# EAGLE design LED (EAGLE 6.5.0)
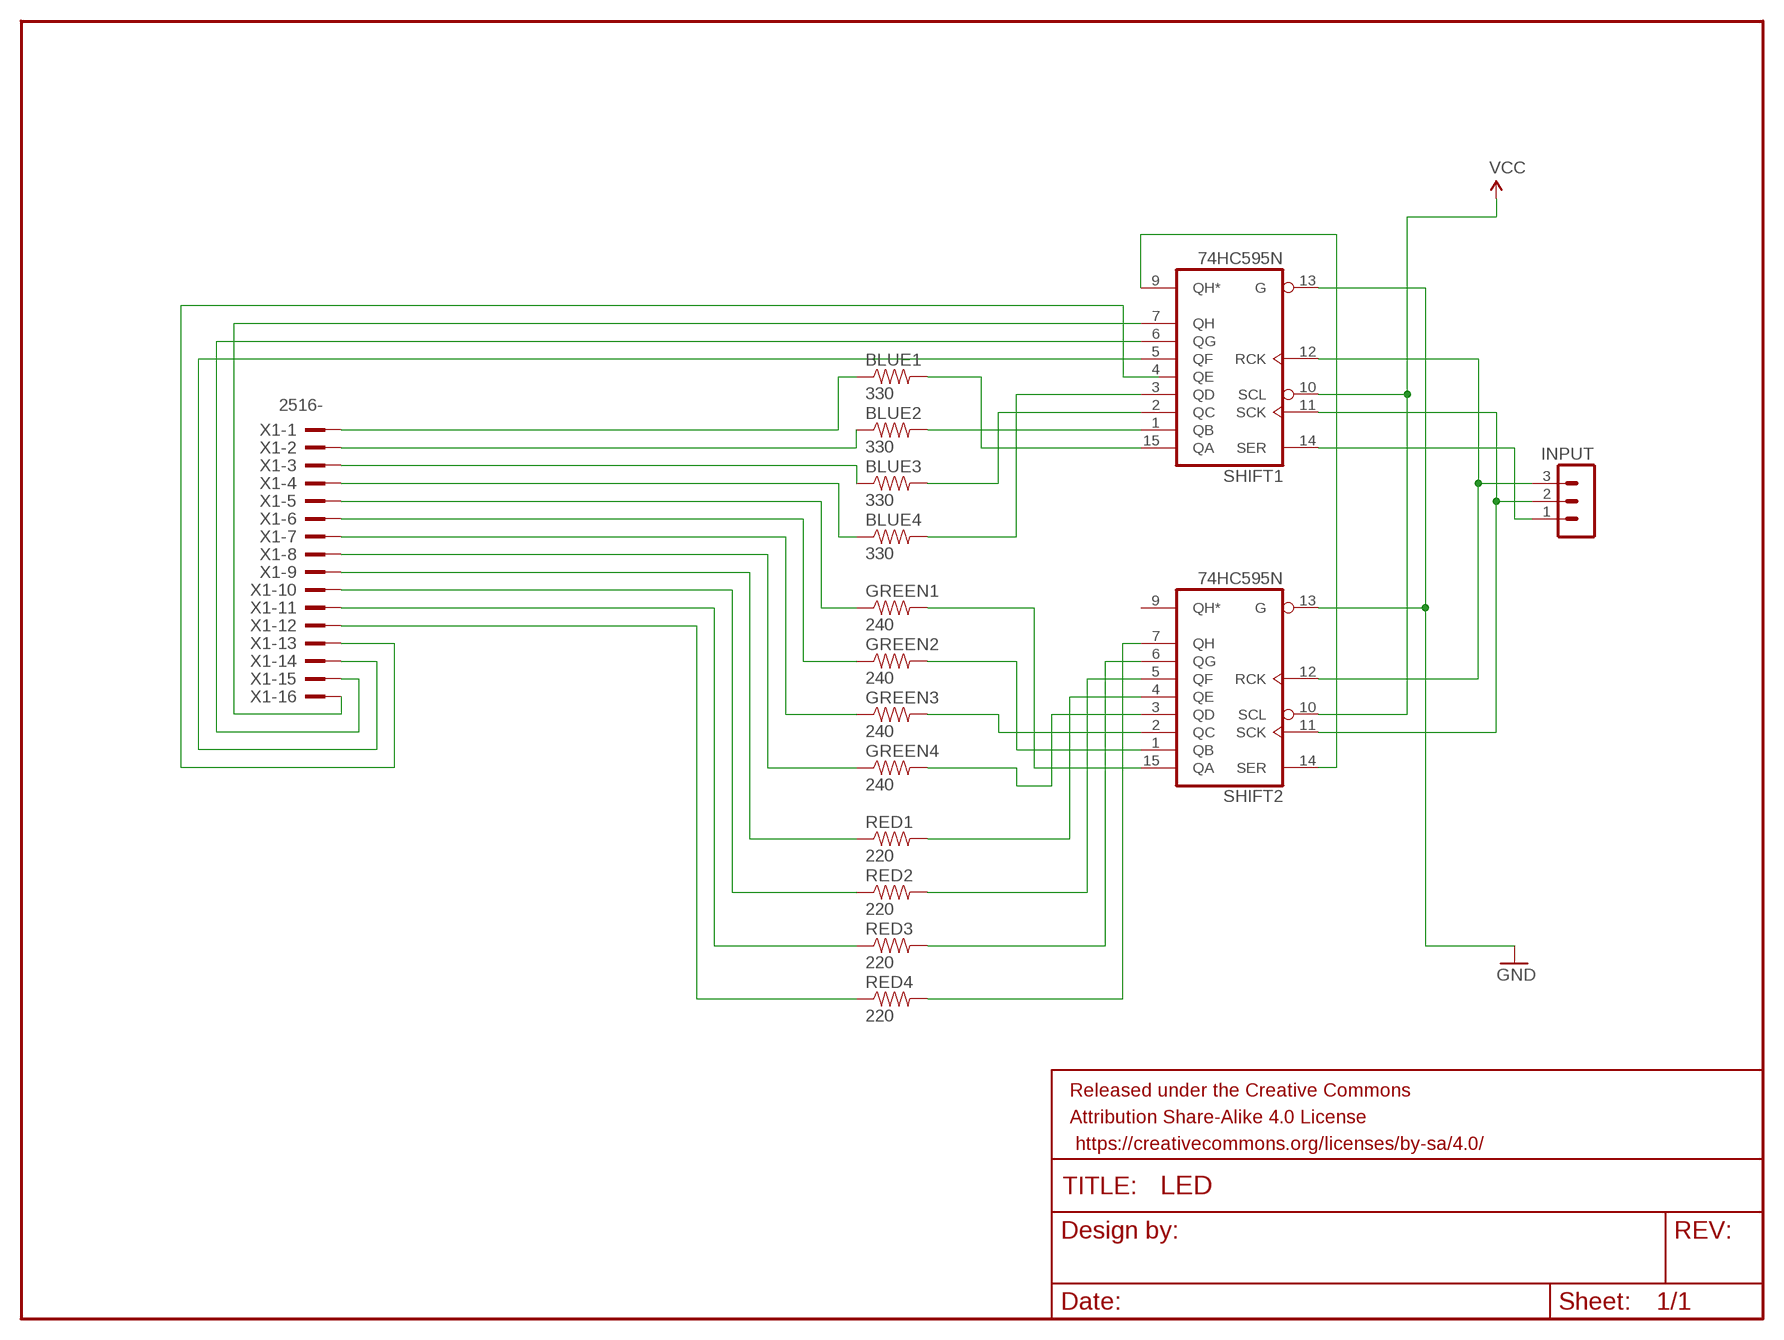
[diagram p0: schematic, sheet 1]

## Parts
BLUE1  330  RESISTOREZ  [AXIAL-0.3EZ]
BLUE2  330  RESISTOREZ  [AXIAL-0.3EZ]
BLUE3  330  RESISTOREZ  [AXIAL-0.3EZ]
BLUE4  330  RESISTOREZ  [AXIAL-0.3EZ]
FRAME1  FRAME-LETTER  [CREATIVE_COMMONS]
GREEN1  240  RESISTOREZ  [AXIAL-0.3EZ]
GREEN2  240  RESISTOREZ  [AXIAL-0.3EZ]
GREEN3  240  RESISTOREZ  [AXIAL-0.3EZ]
GREEN4  240  RESISTOREZ  [AXIAL-0.3EZ]
INPUT  MA03-1  [MA03-1]
RED1  220  RESISTOREZ  [AXIAL-0.3EZ]
RED2  220  RESISTOREZ  [AXIAL-0.3EZ]
RED3  220  RESISTOREZ  [AXIAL-0.3EZ]
RED4  220  RESISTOREZ  [AXIAL-0.3EZ]
SHIFT1  74HC595N  [DIL16]
SHIFT2  74HC595N  [DIL16]
X1  2516-  [PAK100/2500-16]

## Nets
GND: SHIFT1.13(G) SHIFT2.13(G)
N$1: BLUE4.P$1 X1.4
N$2: BLUE3.P$1 X1.3
N$3: BLUE2.P$1 X1.2
N$4: BLUE1.P$1 X1.1
N$5: BLUE1.P$2 SHIFT1.15(QA)
N$6: BLUE2.P$2 SHIFT1.1(QB)
N$7: BLUE3.P$2 SHIFT1.2(QC)
N$8: BLUE4.P$2 SHIFT1.3(QD)
N$9: SHIFT1.7(QH) X1.16
N$10: SHIFT1.6(QG) X1.15
N$11: SHIFT1.5(QF) X1.14
N$12: X1.13
N$13: GREEN1.P$1 X1.5
N$14: GREEN2.P$1 X1.6
N$15: GREEN3.P$1 X1.7
N$16: GREEN4.P$1 X1.8
N$17: RED1.P$1 X1.9
N$18: RED2.P$1 X1.10
N$19: RED3.P$1 X1.11
N$20: RED4.P$1 X1.12
N$21: GREEN1.P$2 SHIFT2.15(QA)
N$22: GREEN2.P$2 SHIFT2.1(QB)
N$23: GREEN3.P$2 SHIFT2.2(QC)
N$24: GREEN4.P$2 SHIFT2.3(QD)
N$25: RED1.P$2 SHIFT2.4(QE)
N$26: RED2.P$2 SHIFT2.5(QF)
N$27: RED3.P$2 SHIFT2.6(QG)
N$28: RED4.P$2 SHIFT2.7(QH)
N$29: INPUT.3 SHIFT1.12(RCK) SHIFT2.12(RCK)
N$30: INPUT.2 SHIFT1.11(SCK) SHIFT2.11(SCK)
N$31: INPUT.1 SHIFT1.14(SER)
N$32: SHIFT1.9(QH*) SHIFT2.14(SER)
VCC: SHIFT1.10(SCL) SHIFT2.10(SCL)
Unconnected: SHIFT1.4(QE) SHIFT2.9(QH*)

## Power pins joined to a net without a drawn wire
GND: SHIFT1.8(GND) SHIFT2.8(GND)
VCC: SHIFT1.16(VCC) SHIFT2.16(VCC)

## Library data of the parts
BLUE1-BLUE4 GREEN1-GREEN4 RED1-RED4 = SparkFun-Resistors:RESISTOR: Resistor Basic schematic elements and footprints for 0603, 1206, and PTH resistors.
FRAME1 = SparkFun-Aesthetics:FRAME-LETTER: Schematic Frame Standard 8.5x11 US Letter frame
INPUT = con-lstb:MA03-1: PIN HEADER; OC_FARNELL: unknown; OC_NEWARK: unknown
SHIFT1 SHIFT2 = 74xx-eu:74*595: 8-bit SHIFT REGISTER, output latch
X1 = con-3m:2516-: 3M (TM) Pak 100 4-Wall Header Source: 3M; OC_FARNELL: unknown; OC_NEWARK: unknown

## Board
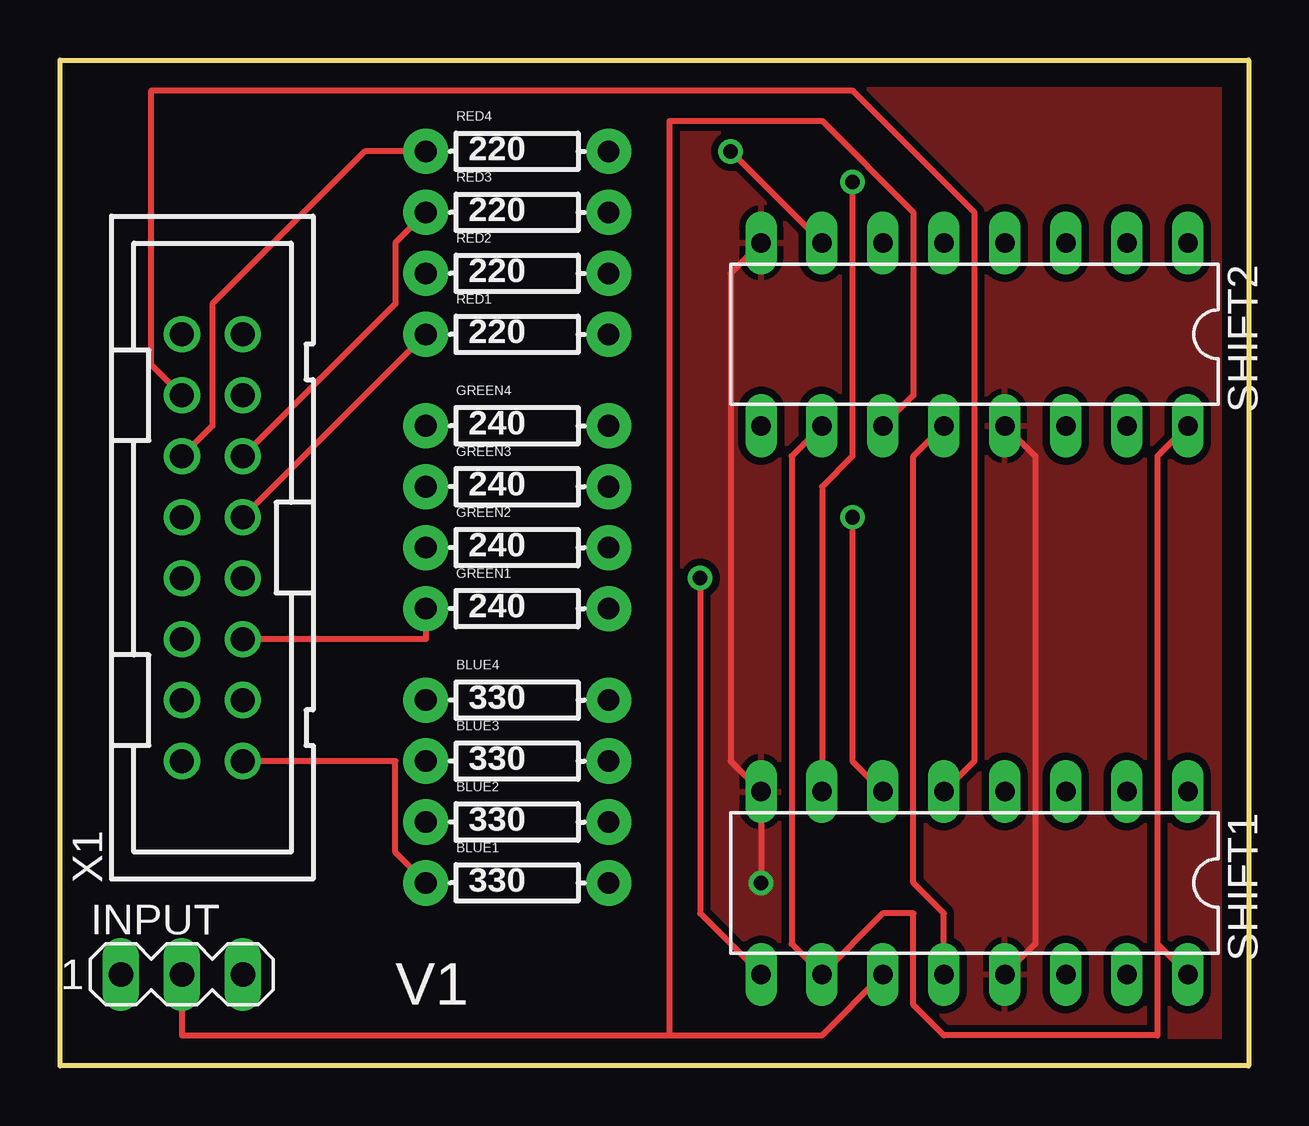
[diagram p1: board, top side]
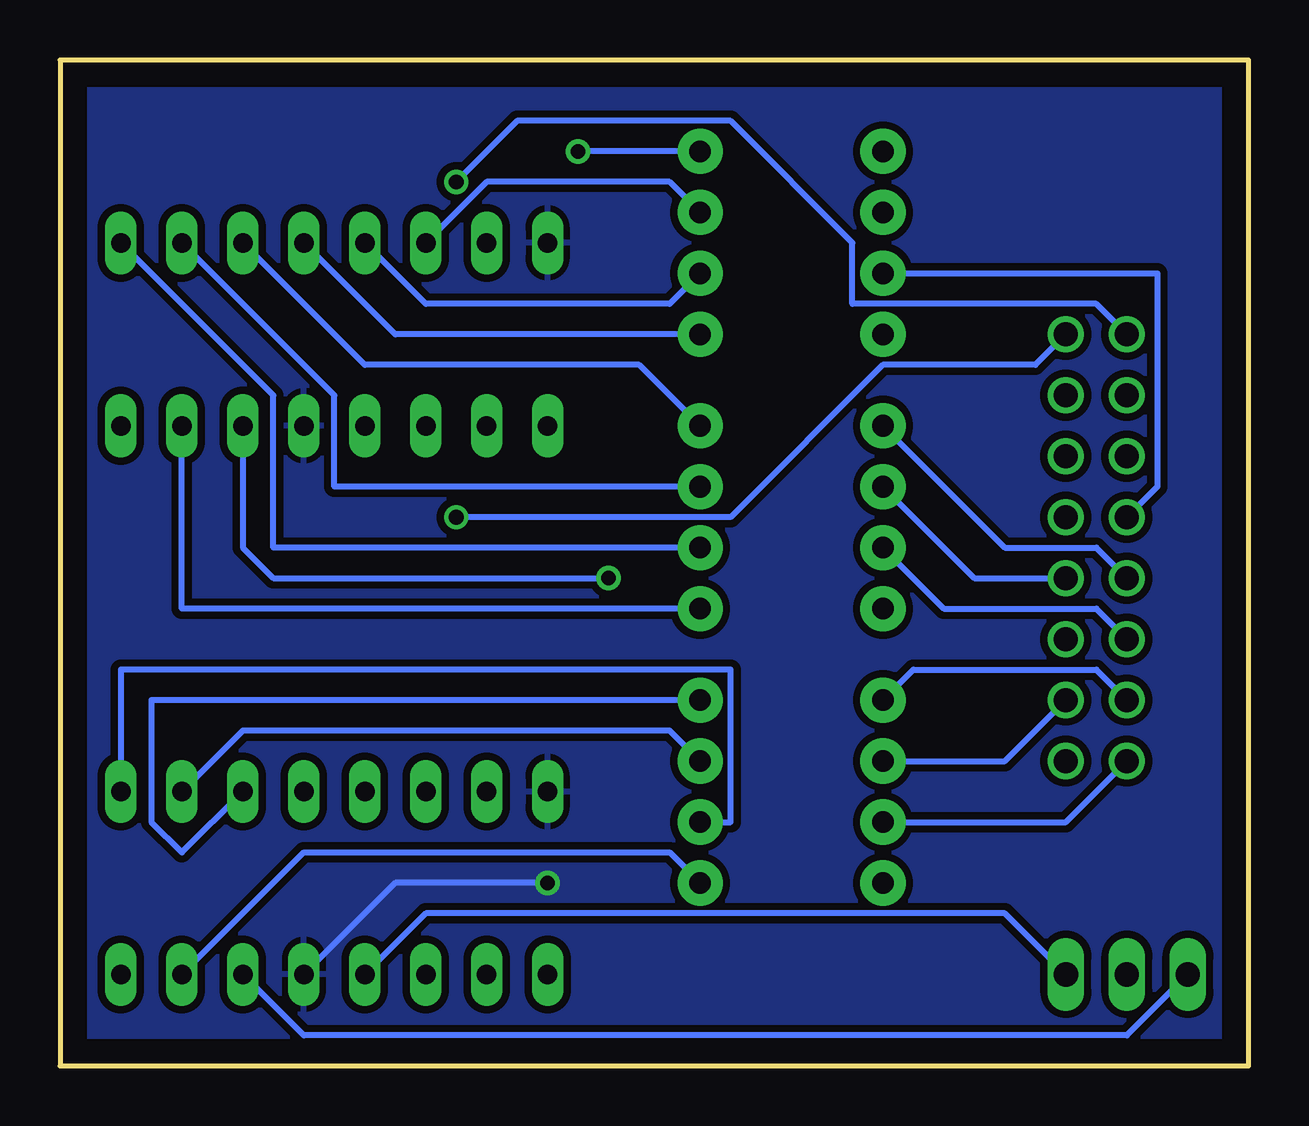
[diagram p2: board, bottom side, seen from below]

Size 49.53 x 41.91 mm. Coordinates in mm from the lower left corner, seen from the top.
Outline: 0,0 0,41.91 49.53,41.91 49.53,0 0,0
Copper layers (1*16): Top 0.035mm / dielectric 1.5mm / Bottom 0.035mm
Design rules "default": minimum track width 10mil, minimum drill 24mil, track to track 8mil, track to pad 8mil, pad to pad 8mil, via to via 8mil, smd to smd 8mil, copper to edge 40mil, drill to drill 8mil, minimum pad ring 10mil, minimum via ring 8mil, stop-mask expansion 4mil, vias tented up to drill 0mil, thermal gap 10mil

### Footprints (pad centres in the part's own frame; a part is rotated, then mirrored left to right if it is on the bottom)
AXIAL-0.3EZ = drill 0.9 pad 1.88: P$1 -3.81,0; P$2 3.81,0
MA03-1 = drill 1.016 long: 1 -2.54,0; 2 0,0; 3 2.54,0
DIL16 = drill 0.813 long: 1 -8.89,-3.81; 2 -6.35,-3.81; 3 -3.81,-3.81; 4 -1.27,-3.81; 5 1.27,-3.81; 6 3.81,-3.81; 7 6.35,-3.81; 8 8.89,-3.81; 9 8.89,3.81; 10 6.35,3.81; 11 3.81,3.81; 12 1.27,3.81; 13 -1.27,3.81; 14 -3.81,3.81; 15 -6.35,3.81; 16 -8.89,3.81
PAK100/2500-16 = drill 1 pad 1.422: 1 -8.89,-1.27; 2 -8.89,1.27; 3 -6.35,-1.27; 4 -6.35,1.27; 5 -3.81,-1.27; 6 -3.81,1.27; 7 -1.27,-1.27; 8 -1.27,1.27; 9 1.27,-1.27; 10 1.27,1.27; 11 3.81,-1.27; 12 3.81,1.27; 13 6.35,-1.27; 14 6.35,1.27; 15 8.89,-1.27; 16 8.89,1.27

### Placement (x,y rotation side)
BLUE1  19.05,7.62 0 top
BLUE2  19.05,10.16 0 top
BLUE3  19.05,12.7 0 top
BLUE4  19.05,15.24 0 top
FRAME1  -78.74,36.83 0 top  (outside the outline)
GREEN1  19.05,19.05 0 top
GREEN2  19.05,21.59 0 top
GREEN3  19.05,24.13 0 top
GREEN4  19.05,26.67 0 top
INPUT  5.08,3.81 0 top
RED1  19.05,30.48 0 top
RED2  19.05,33.02 0 top
RED3  19.05,35.56 0 top
RED4  19.05,38.1 0 top
SHIFT1  38.1,7.62 180 top
SHIFT2  38.1,30.48 180 top
X1  6.35,21.59 90 top

### Tracks (layer width: path | path; a pad name or v marks a point on that pad's centre or on a via)
GND  (via drill 0.61)
  Top 0.254: SHIFT1.13 40.64,5.08 40.64,25.4 SHIFT2.13 | SHIFT2.8 27.94,33.02 27.94,12.7 SHIFT1.8 v29.21,7.62
  Bottom 0.254: SHIFT1.13 35.56,7.62 v29.21,7.62
  pour Top (isolate 0.305): 0,0 0,41.91 49.53,41.91 49.53,0
  pour Bottom (isolate 0.305): 0,0 0,41.91 49.53,41.91 49.53,0
N$1
  Bottom 0.254: X1.4 6.35,16.51 13.97,16.51 BLUE4.P$1
N$2
  Bottom 0.254: X1.3 10.16,12.7 BLUE3.P$1
N$3
  Bottom 0.254: X1.2 7.62,10.16 BLUE2.P$1
N$4
  Top 0.254: X1.1 13.97,12.7 13.97,8.89 BLUE1.P$1
N$5
  Bottom 0.254: SHIFT1.15 39.37,8.89 24.13,8.89 BLUE1.P$2
N$6
  Bottom 0.254: SHIFT1.1 46.99,16.51 21.59,16.51 21.59,10.16 BLUE2.P$2
N$7
  Bottom 0.254: SHIFT1.2 41.91,13.97 24.13,13.97 BLUE3.P$2
N$8
  Bottom 0.254: SHIFT1.3 44.45,8.89 45.72,10.16 45.72,15.24 BLUE4.P$2
N$9  (via drill 0.61)
  Top 0.254: SHIFT1.7 31.75,24.13 33.02,25.4 v33.02,36.83
  Bottom 0.254: v33.02,36.83 30.48,39.37 21.59,39.37 16.51,34.29 16.51,31.75 6.35,31.75 X1.16
N$10  (via drill 0.61)
  Top 0.254: SHIFT1.6 33.02,12.7 v33.02,22.86
  Bottom 0.254: v33.02,22.86 21.59,22.86 15.24,29.21 8.89,29.21 X1.15
N$11
  Top 0.254: SHIFT1.5 38.1,12.7 38.1,35.56 33.02,40.64 3.81,40.64 3.81,29.21 X1.14
N$13
  Top 0.254: X1.5 15.24,17.78 GREEN1.P$1
N$14
  Bottom 0.254: X1.6 6.35,19.05 12.7,19.05 GREEN2.P$1
N$15
  Bottom 0.254: X1.7 11.43,20.32 GREEN3.P$1
N$16
  Bottom 0.254: X1.8 6.35,21.59 10.16,21.59 GREEN4.P$1
N$17
  Top 0.254: RED1.P$1 X1.9
N$18
  Bottom 0.254: X1.10 3.81,24.13 3.81,33.02 RED2.P$1
N$19
  Top 0.254: X1.11 13.97,31.75 13.97,34.29 RED3.P$1
N$20
  Top 0.254: X1.12 6.35,26.67 6.35,31.75 12.7,38.1 RED4.P$1
N$21
  Bottom 0.254: SHIFT2.15 44.45,19.05 GREEN1.P$2
N$22
  Bottom 0.254: SHIFT2.1 40.64,27.94 40.64,21.59 GREEN2.P$2
N$23
  Bottom 0.254: SHIFT2.2 38.1,27.94 38.1,24.13 GREEN3.P$2
N$24
  Bottom 0.254: SHIFT2.3 36.83,29.21 25.4,29.21 GREEN4.P$2
N$25
  Bottom 0.254: SHIFT2.4 35.56,30.48 RED1.P$2
N$26
  Bottom 0.254: SHIFT2.5 34.29,31.75 24.13,31.75 RED2.P$2
N$27
  Bottom 0.254: SHIFT2.6 31.75,36.83 24.13,36.83 RED3.P$2
N$28  (via drill 0.61)
  Top 0.254: v27.94,38.1 SHIFT2.7
  Bottom 0.254: RED4.P$2 v27.94,38.1
N$29
  Top 0.254: SHIFT2.12 35.56,25.4 35.56,7.62 36.83,6.35 SHIFT1.12
  Bottom 0.254: SHIFT1.12 34.29,6.35 10.16,6.35 INPUT.3
N$30
  Top 0.254: SHIFT1.11 31.75,1.27 25.4,1.27 | 25.4,1.27 5.08,1.27 INPUT.2 | SHIFT2.11 35.56,27.94 35.56,35.56 31.75,39.37 25.4,39.37 25.4,1.27
N$31
  Bottom 0.254: SHIFT1.14 39.37,1.27 5.08,1.27 INPUT.1
N$32  (via drill 0.61)
  Top 0.254: SHIFT1.9 26.67,6.35 v26.67,20.32
  Bottom 0.254: v26.67,20.32 40.64,20.32 41.91,21.59 SHIFT2.14
VCC
  Top 0.254: SHIFT2.10 30.48,25.4 30.48,5.08 SHIFT1.10 34.29,6.35 35.56,6.35 35.56,2.54 36.83,1.27 45.72,1.27 45.72,5.08 | 45.72,5.08 SHIFT1.16 | 45.72,5.08 45.72,25.4 SHIFT2.16

### Text on the board
tPlace: V1